# EAGLE schematic TTGO-TS-dash-display (EAGLE 9.6.2)
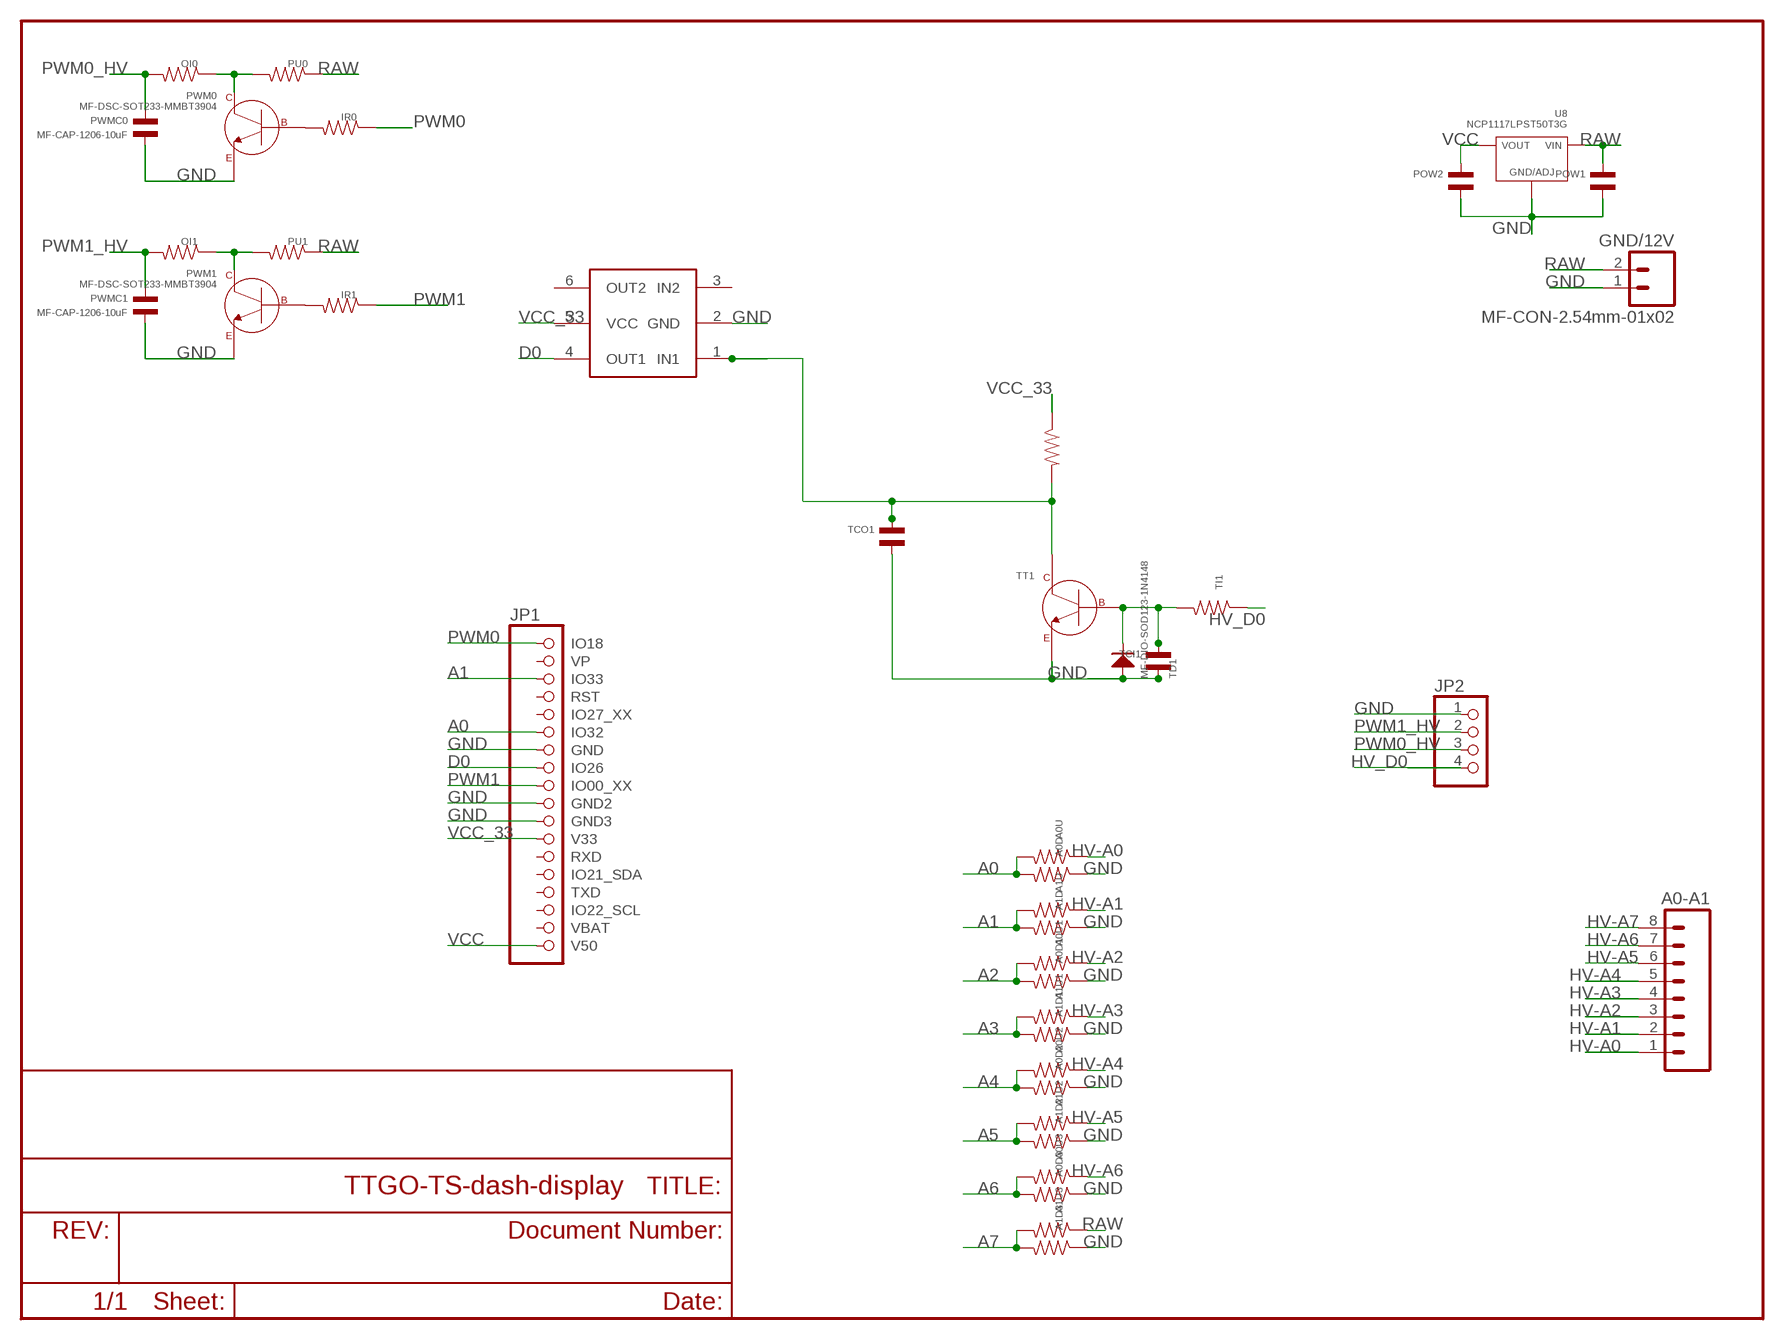
[diagram p0: schematic, sheet 1]

## Parts
A0-A1  MF-CON-2.54mm-01x08  M081X08  [1X08]
A0D  RESISTOR_1206  [R1206]
A0D1  RESISTOR_1206  [R1206]
A0D2  RESISTOR_1206  [R1206]
A0D3  RESISTOR_1206  [R1206]
A0U  RESISTOR_1206  [R1206]
A0U1  RESISTOR_1206  [R1206]
A0U2  RESISTOR_1206  [R1206]
A0U3  RESISTOR_1206  [R1206]
A1D  RESISTOR_1206  [R1206]
A1D1  RESISTOR_1206  [R1206]
A1D2  RESISTOR_1206  [R1206]
A1D3  RESISTOR_1206  [R1206]
A1U  RESISTOR_1206  [R1206]
A1U1  RESISTOR_1206  [R1206]
A1U2  RESISTOR_1206  [R1206]
A1U3  RESISTOR_1206  [R1206]
GND/12V  MF-CON-2.54mm-01x02  M02PTH  [1X02]
IR0  RESISTOR_1206  [R1206]
IR1  RESISTOR_1206  [R1206]
JP1  000_ESP32_D1MINI  [00_2X9]
JP2  HEADER-1X4  [1X04_OVAL]
OI0  RESISTOR_1206  [R1206]
OI1  RESISTOR_1206  [R1206]
POW1  CAPACITOR_NP_1210  [C1210]
POW2  CAPACITOR_NP_1210  [C1210]
PU0  RESISTOR_1206  [R1206]
PU1  RESISTOR_1206  [R1206]
PWM0  MF-DSC-SOT233-MMBT3904  NPN_BJTMMBT3904_SOT-23-3  [SOT-23-3]
PWM1  MF-DSC-SOT233-MMBT3904  NPN_BJTMMBT3904_SOT-23-3  [SOT-23-3]
PWMC0  MF-CAP-1206-10uF  CAPACITOR_NP_1206  [C1206]
PWMC1  MF-CAP-1206-10uF  CAPACITOR_NP_1206  [C1206]
TCI1  CAPACITOR_NP_1210  [C1210]
TCO1  CAPACITOR_NP_1210  [C1210]
TD1  MF-DIO-SOD123-1N4148  DIODES_1N4148_SOD-123  [SOD-123]
TI1  RESISTOR_1206  [R1206]
TT1  MF-DSC-SOT233-MMBT3904  NPN_BJTMMBT3904_SOT-23-3  [SOT-23-3]
TU1  RESISTOR_1206  [R1206]
U8  NCP1117LPST50T3G  [SOT-223-3]
U$1  000_DUAL-SCHMITT-INVERTER  [SOT23-6]

## Nets
A0: A0D.P$2 A0U.P$2 JP1.6(IO32)
A1: A1D.P$2 A1U.P$2 JP1.3(IO33)
A2: A0D1.P$2 A0U1.P$2
A3: A1D1.P$2 A1U1.P$2
A4: A0D2.P$2 A0U2.P$2
A5: A1D2.P$2 A1U2.P$2
A6: A0D3.P$2 A0U3.P$2
A7: A1D3.P$2 A1U3.P$2
D0: JP1.8(IO26) U$1.4(OUT1)
GND [hc]: A0D1.P$1 A0D2.P$1 A0D3.P$1 A0D.P$1 A1D1.P$1 A1D2.P$1 A1D3.P$1 A1D.P$1 GND/12V.1 JP1.7(GND) JP1.10(GND2) JP1.11(GND3) JP2.1 POW1.P$2 POW2.P$2 PWM0.P$2(EMITTER) PWM1.P$2(EMITTER) PWMC0.P$2 PWMC1.P$2 TCI1.P$2 TCO1.P$2 TD1.ANODE TT1.P$2(EMITTER) U8.P$2(GND/ADJ) U$1.2(GND)
HV-A0: A0-A1.1 A0U.P$1
HV-A1: A0-A1.2 A1U.P$1
HV-A2: A0-A1.3 A0U1.P$1
HV-A3: A0-A1.4 A1U1.P$1
HV-A4: A0-A1.5 A0U2.P$1
HV-A5: A0-A1.6 A1U2.P$1
HV-A6: A0-A1.7 A0U3.P$1
HV-A7: A0-A1.8
HV_D0: JP2.4 TI1.P$1
IO21_D1: TCO1.P$1 TT1.P$3(COLLECTOR) TU1.P$2 U$1.1(IN1)
N$1: TCI1.P$1 TD1.CATHODE TI1.P$2 TT1.P$1(BASE)
N$5: OI1.P$1 PU1.P$2 PWM1.P$3(COLLECTOR)
N$6: IR1.P$2 PWM1.P$1(BASE)
N$11: OI0.P$1 PU0.P$2 PWM0.P$3(COLLECTOR)
N$12: IR0.P$2 PWM0.P$1(BASE)
PWM0: IR0.P$1 JP1.1(IO18)
PWM0_HV: JP2.3 OI0.P$2 PWMC0.P$1
PWM1: IR1.P$1 JP1.9(IO00_XX)
PWM1_HV: JP2.2 OI1.P$2 PWMC1.P$1
RAW: A1U3.P$1 GND/12V.2 POW1.P$1 PU0.P$1 PU1.P$1 U8.P$4(VIN)
VCC [hc]: JP1.18(V50) POW2.P$1 U8.P$1(VOUT) U8.P$3(VOUT)
VCC_33: JP1.12(V33) TU1.P$1 U$1.5(VCC)
Unconnected: JP1.2(VP) JP1.4(RST) JP1.5(IO27_XX) JP1.13(RXD) JP1.14(IO21_SDA) JP1.15(TXD) JP1.16(IO22_SCL) JP1.17(VBAT) U$1.3(IN2) U$1.6(OUT2)

## Library data of the parts
A0-A1 = SparkFun-Connectors:M08: Header 8 Standard 8-pin 0.1" header. Use with straight break away headers (SKU : PRT-00116), right angle break away headers (PRT-00553), swiss pins (PRT-00743), machine pins (PRT-00117), and female headers (PRT-00115).
A0D A0D1-A0D3 A0U A0U1-A0U3 A1D A1D1-A1D3 A1U A1U1-A1U3 IR0 IR1 OI0 OI1 PU0 PU1 TI1 TU1 = MF_Passives:RESISTOR: Library: MF_Passives Description: Device for Resistors. Manufacture part number (MPN), Voltage, Tolerance, and Wattage Rating can be added via Attributes. Check https://factory.macrofab.com/parts for the house parts list.; POPULATE: 1
GND/12V = SparkFun-Connectors:M02: Standard 2-pin 0.1" header. Use with - straight break away headers ( PRT-00116) - right angle break away headers (PRT-00553) - swiss pins (PRT-00743) - machine pins (PRT-00117) - female headers (PRT-00115) Molex polarized connector foot print use with: PRT-08233 with associated crimp pins and housings. 2.54_SCREWTERM for use with PRT-10571. 3.5mm Screw Terminal footprints for PRT-08084 5mm Screw Terminal footprints for use with PRT-08433
JP1 = microbuilder:000_ESP32_D1MINI: PIN HEADER
JP2 = 00jim:HEADER-1X4: PIN HEADER
POW1 POW2 PWMC0 PWMC1 TCI1 TCO1 = MF_Passives:CAPACITOR_NP: Library: MF_Passives Description: Device for Non-Polarized Capacitors. Manufacture part number (MPN) can be added via Attributes. Check https://factory.macrofab.com/parts for the house parts list.; POPULATE: 1
PWM0 PWM1 TT1 = MF_Discrete_Semiconductor:NPN_BJT: Library: MF_Discrete_Semiconductor Description: Device for Single NPN BJT Transistors. Manufacture part number (MFG#) can be added via Attributes.; HOUSEPART: YES; MPN: MF-DSC-SOT233-MMBT3904; POPULATE: 1; URL: https://factory.macrofab.com/part/MF-DSC-SOT233-MMBT3904
TD1 = MF_Discrete_Semiconductor:DIODES: Library: MF_Discrete_Semiconductor Description: Device for Single Packaged Diodes.; HOUSEPART: YES; MPN: MF-DIO-SOD123-1N4148; POPULATE: 1; URL: https://factory.macrofab.com/part/MF-DIO-SOD123-1N4148
U8 = MF_IC_Power:NCP1117LP: Manufacturer Part #: NCP1117LP Manufacturer: ON Semiconductor Description: LDO Voltage Regulators; HOUSEPART: NO; MPN: NCP1117LPST50T3G; POPULATE: 1; URL: http://www.onsemi.com/pub_link/Collateral/NCP1117LP-D.PDF
U$1 = microbuilder:000_DUAL-SCHMITT-INVERTER

## Net classes
1 vcc: width 0.762 mm
3 hc: width 0.762 mm